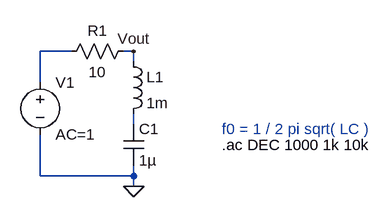
[diagram p0: schematic lc-notch-filter.asc]
lc-notch-filter.asc, the LTspice schematic file:
Version 4
SHEET 1 592 352
WIRE 96 128 48 128
WIRE 192 128 176 128
WIRE 192 144 192 128
WIRE 48 176 48 128
WIRE 192 240 192 224
WIRE 48 320 48 256
WIRE 192 320 192 304
WIRE 192 320 48 320
WIRE 192 336 192 320
FLAG 192 336 0
FLAG 192 128 Vout
SYMBOL Res 192 112 R90
WINDOW 0 0 56 VBottom 2
WINDOW 3 32 56 VTop 2
SYMATTR InstName R1
SYMATTR Value 10
SYMBOL Cap 176 240 R0
SYMATTR InstName C1
SYMATTR Value 1µ
SYMBOL Ind 176 128 R0
SYMATTR InstName L1
SYMATTR Value 1m
SYMBOL Voltage 48 160 R0
SYMATTR InstName V1
SYMATTR Value AC=1
TEXT 328 272 Left 2 !.ac DEC 1000 1k 10k
TEXT 328 248 Left 2 ;f0 = 1 / 2 pi sqrt( LC )

The netlist it stands for:
* lc-notch-filter.asc
R1 Vout N001 10
C1 N002 0 1µ
L1 Vout N002 1m
V1 N001 0 AC=1
.ac DEC 1000 1k 10k
* f0 = 1 / 2 pi sqrt( LC )
.backanno
.end